# EAGLE design nand (EAGLE 9.6.2)
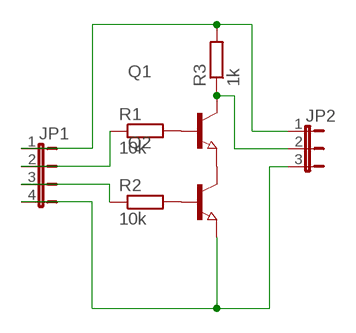
[diagram p0: schematic, sheet 1]

## Parts
JP1  JP4E  [JP4]
JP2  JP2W  [JP2W]
Q1  NPN-TRANSISTOR_SOT23  [SOT23]
Q2  NPN-TRANSISTOR_SOT23  [SOT23]
R1  10k  R-EU_R1206  [R1206]
R2  10k  R-EU_R1206  [R1206]
R3  1k  R-EU_R1206  [R1206]

## Nets
N$1: Q1.2(E) Q2.3(C)
N$2: Q1.1(B) R1.2
N$3: Q2.1(B) R2.2
N$6: JP1.2 R1.1
N$7: JP1.3 R2.1
N$8: JP1.4 JP2.3 Q2.2(E)
N$9: JP1.1 JP2.1 R3.2
N$10: JP2.2 Q1.3(C) R3.1

## Library data of the parts
JP1 = jumper:JP4E: JUMPER
JP2 = jumper:JP2W: JUMPER
Q1 Q2 = semicon-smd-ipc:NPN-TRANSISTOR_: NPN TRANSISTOR
R1-R3 = rcl:R-EU_: RESISTOR, European symbol; SPICEPREFIX: R

## Net classes
0 default: width 1.27 mm

## Board
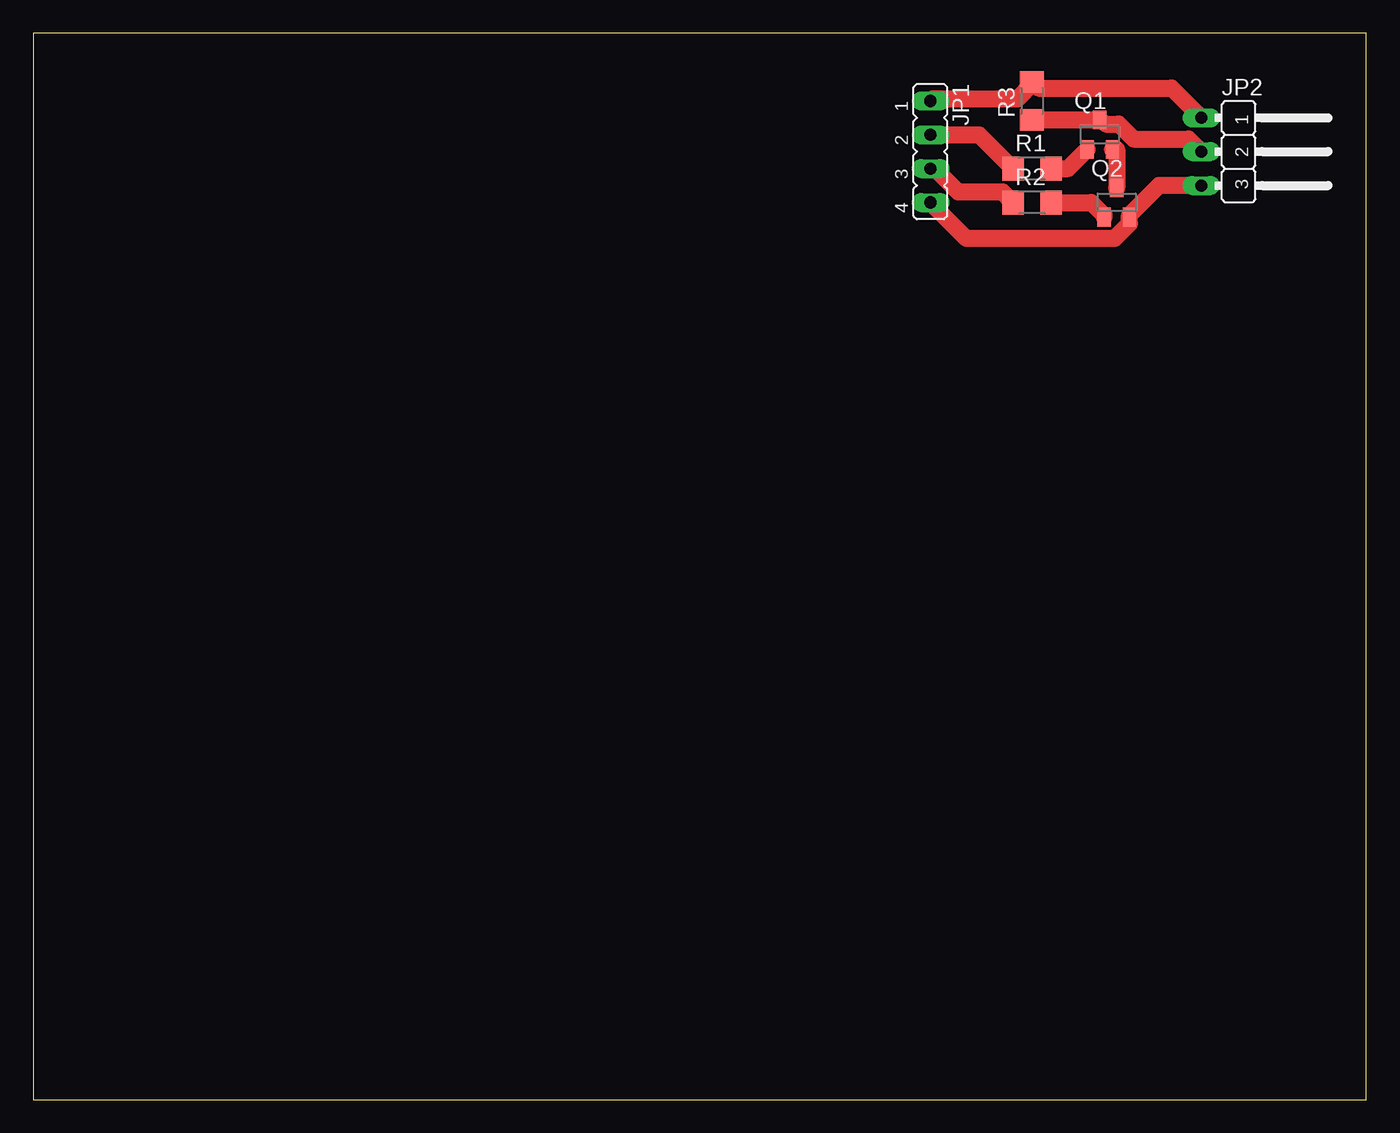
[diagram p1: board, top side]

Size 100 x 80 mm. Coordinates in mm from the lower left corner, seen from the top.
Outline: 0,0 100,0 100,80 0,80 0,0
Copper layers (1*16): Top 0.035mm / dielectric 1.5mm / Bottom 0.035mm
Design rules "default": minimum track width 6mil, minimum drill 0.35mm, track to track 6mil, track to pad 6mil, pad to pad 6mil, via to via 6mil, smd to smd 6mil, copper to edge 40mil, drill to drill 6mil, minimum pad ring 10mil, minimum via ring 8mil, stop-mask expansion 4mil, vias tented up to drill 0mil, thermal gap 10mil

### Footprints (pad centres in the part's own frame; a part is rotated, then mirrored left to right if it is on the bottom)
JP4 = drill 0.914 long: 1 -3.81,0; 2 -1.27,0; 3 1.27,0; 4 3.81,0
JP2W = drill 0.914 long: 1 -2.54,-1.27; 2 0,-1.27; 3 2.54,-1.27
SOT23 = smd 1 x 1.4: 1 -0.95,-1.1; 2 0.95,-1.1; 3 0,1.1
R1206 = smd 1.6 x 1.803: 1 -1.422,0; 2 1.422,0

### Placement (x,y rotation side)
JP1  67.31,71.12 270 top
JP2  88.9,71.12 270 top
Q1  80.01,72.39 0 top
Q2  81.28,67.31 0 top
R1  74.93,69.85 0 top
R2  74.93,67.31 0 top
R3  74.93,74.93 90 top

### Tracks (layer width: path | path; a pad name or v marks a point on that pad's centre or on a via)
N$1
  Top 1.27: Q2.3 81.28,71.28 80.96,71.28 Q1.2
N$2
  Top 1.27: R1.2 77.63,69.85 79.06,71.28 Q1.1
N$3
  Top 1.27: R2.2 79.38,67.31 80.33,66.36 Q2.1
N$6
  Top 1.27: JP1.2 70.96,72.39 R1.1
N$7
  Top 1.27: JP1.3 67.63,69.85 69.37,68.1 72.71,68.1 R2.1
N$8
  Top 1.27: JP2.3 84.45,68.58 82.23,66.36 Q2.2 82.23,65.72 81.12,64.61 70.01,64.61 JP1.4
N$9
  Top 1.27: JP1.1 67.47,75.09 73.82,75.09 74.93,76.2 R3.2 75.41,75.88 85.41,75.88 JP2.1
N$10
  Top 1.27: R3.1 80.01,73.5 Q1.3 80.49,73.18 81.44,73.18 82.55,72.07 86.68,72.07 JP2.2